# Altium schematic sheet Teensy Schematic.SchDoc
size 431 x 279 mm; SheetNumber: 2; SheetTotal: 6; ENG_APP_DATE: --/--/--; DSN_APP_DATE: --/--/--; CHK_APP_DATE: --/--/--
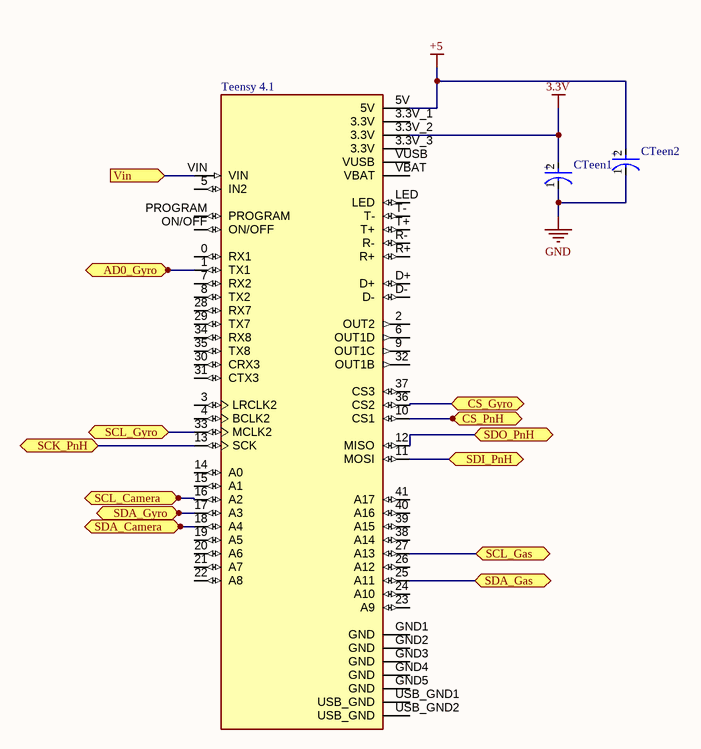
[diagram p0: Teensy Schematic.SchDoc]

## Parts
CTeen1  293D105X0016A2TE3  [FP-293DA-MFG]  (value not drawn)
CTeen2  293D105X0016A2TE3  [FP-293DA-MFG]  (value not drawn)
Teensy_4.1  Teensy 4.1  [MODULE_DEV-16771]  (value not drawn)

## Ports
AD0_Gyro (bidir), CS_Gyro (bidir), CS_PnH (bidir), SCK_PnH (bidir), SCL_Camera (bidir), SCL_Gas (bidir), SCL_Gyro (bidir), SDA_Camera (bidir), SDA_Gas (bidir), SDA_Gyro (bidir), SDI_PnH (bidir), SDO_PnH (bidir), Vin (in)

## Nets
3.3V: CTeen1.2(A) Teensy_4.1.3.3V_2(3.3V)
+5: CTeen2.2(A) Teensy_4.1.5V
GND: CTeen1.1(C) CTeen2.1(C)
AD0_Gyro: Teensy_4.1.1(TX1) ; port AD0_Gyro
CS_Gyro: Teensy_4.1.36(CS2) ; port CS_Gyro
CS_PnH: Teensy_4.1.10(CS1) ; port CS_PnH
SCK_PnH: Teensy_4.1.13(SCK) ; port SCK_PnH
SCL_Camera: Teensy_4.1.16(A2) ; port SCL_Camera
SCL_Gas: Teensy_4.1.27(A13) ; port SCL_Gas
SCL_Gyro: Teensy_4.1.33(MCLK2) ; port SCL_Gyro
SDA_Camera: Teensy_4.1.18(A4) ; port SDA_Camera
SDA_Gas: Teensy_4.1.25(A11) ; port SDA_Gas
SDA_Gyro: Teensy_4.1.17(A3) ; port SDA_Gyro
SDI_PnH: Teensy_4.1.11(MOSI) ; port SDI_PnH
SDO_PnH: Teensy_4.1.12(MISO) ; port SDO_PnH
Vin: Teensy_4.1.VIN ; port Vin

Not connected (* = marked no-connect by the designer): Teensy_4.1 0(RX1) 2(OUT2) 3(LRCLK2) 3.3V_1(3.3V) 3.3V_3(3.3V) 4(BCLK2) 5(IN2) 6(OUT1D) 7(RX2) 8(TX2) 9(OUT1C) 14(A0) 15(A1) 19(A5) 20(A6) 21(A7) 22(A8) 23(A9) 24(A10) 26(A12) 28(RX7) 29(TX7) 30(CRX3) 31(CTX3) 32(OUT1B) 34(RX8) 35(TX8) 37(CS3) 38(A14) 39(A15) 40(A16) 41(A17) D+ D- GND1(GND) GND2(GND) GND3(GND) GND4(GND) GND5(GND) LED ON/OFF PROGRAM R+ R- T+ T- USB_GND1(USB_GND) USB_GND2(USB_GND) VBAT VUSB

## Notes on the sheet
- DWG. NO.
- REV.
- SHT.
- THIS DOCUMENT AND THE DATA DISCLOSED HEREIN OR HEREWITH IS THE PROPERTY OF ALTIUM LIMITED AND MAY BE FREELY DISTRIBUTED IN WHOLE. NO RIGHTS ARE RESERVED OR EXPRESS OR IMPLIED WARANTEE GIVEN.
- REVISION
- DESCRIPTION
- DATE
- APPROVED
- ENG:
- APPROVALS
- PROJECT
- DSN:
- CHK:
- REFERENCE DOCUMENTS
- PROJECT REVISION:
- TITLE
- DOCUMENT REVISION:
- DESIGN ITEM:
- BOM:
- FAB DWG:
- PCB DWG:
- ASSY DWG:
- SCALE:
- SIZE
- B
- CAGE CODE
- FILE NAME
- DWG NO.
- SHEET
- OF
- REV
- (in symbol CMP-00030-40940187-1) +

## Library data of the parts
CTeen1 CTeen2 = CMP-00030-40940187-1: 293D105X0016A2TE3 Surface Mount Tantalum Capacitor, 1 uF, 16 V, ± 20%, -55 °C, 125 °C, 1206 [3216-18 Metric]; Ripple Current: 90mA; Capacitance: 1µF; Leakage Current: 500nA; Polarity: Polar; Voltage Rating (DC): 16V; Dissipation Factor: 4%; ESR (Equivalent Series Resistance): 9.3Ω; Case Code (Imperial): 1206; Case/Package: 1206; Schedule B: 8532210050, 8532210050; Height: 1.8mm; Mount: PCB, Surface Mount; Height - Seated (Max): 1.8034mm; Min Operating Temperature: -55°C; Max Operating Temperature: 125°C; Dielectric Material: Tantalum; Packaging: Tape and Reel; Radiation Hardening: No; Lead Free: Lead Free; Features: General Purpose; REACH SVHC: Unknown; Width: 1.6002mm; RoHS: Compliant; Tolerance: 20%; Termination: SMD/SMT; Length: 3.2mm; Depth: 1.6mm; Number of Pins: 2; Voltage Rating: 16V; NexarPartId: 40940187; Case Code (Metric): 3216
Teensy_4.1 = CMP-003-000000-1: RT1062 Teensy 4.1 series ARMÂ® CortexÂ®-M7 MPU Embedded Evaluation Board; MF: SparkFun Electronics; MP: DEV-16771; Package: None; Component Type: Standard; Pin Count: 65; Purchase-URL: https://pricing.snapeda.com/search/part/DEV-16771/?ref=eda; SnapEDA_Link: https://www.snapeda.com/parts/DEV-16771/SparkFun+Electronics/view-part/?ref=snap; Availability: In Stock; Source: DEV-16771.SchLib; Design Item ID: DEV-16771; Check_prices: https://www.snapeda.com/parts/DEV-16771/SparkFun+Electronics/view-part/?ref=eda; Value: *; Price: None